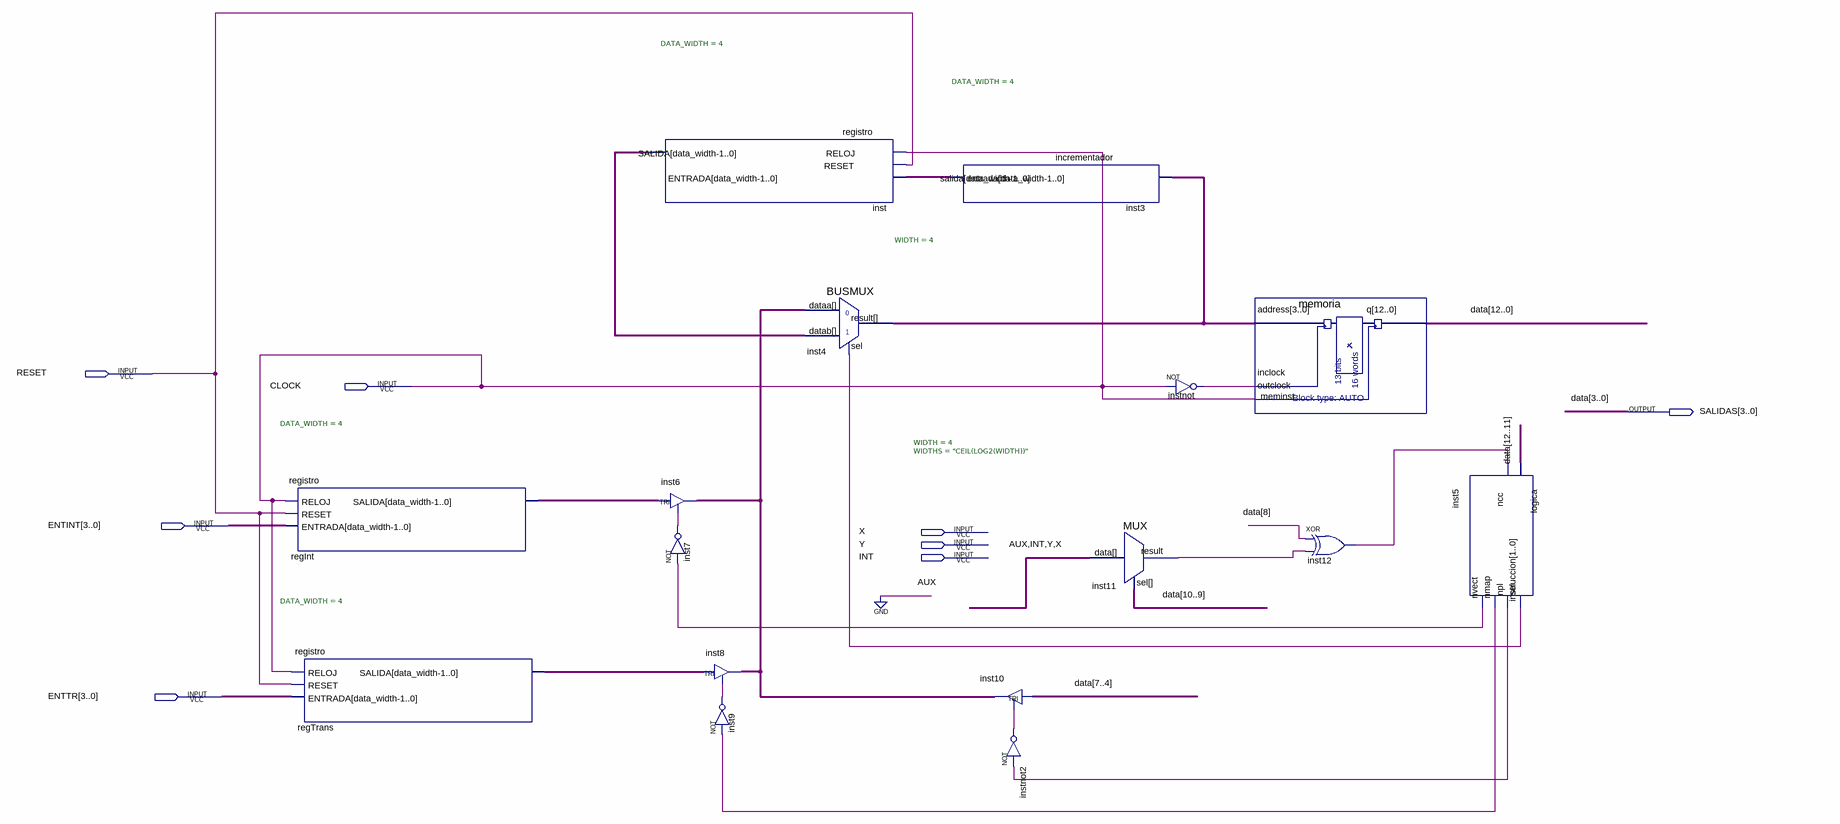
[diagram p0: schematic sheet]
// Quartus schematic secuenciador.bdf as structural Verilog: 16 symbols, 8 pins
module secuenciador (
  input  RESET,
  input  CLOCK,
  input  [3:0] ENTINT,
  input  X,
  input  Y,
  input  INT,
  input  [3:0] ENTTR,
  output [3:0] SALIDAS
);

  wire inst5_nmap, inst5_npl, inst5_nvect, inst5_sel, inst7_out, inst9_out, inst11_result, inst12_out,
       instnot2_out, instnot_out;
  wire [3:0] inst3_salida, inst4_result, inst6_out, inst_salida, regInt_salida, regTrans_salida;
  wire [12:4] data;

  registro #(.DATA_WIDTH(4)) regInt (.RELOJ(CLOCK), .RESET(RESET), .ENTRADA(ENTINT), .SALIDA(regInt_salida));
  registro #(.DATA_WIDTH(4)) regTrans (.RELOJ(CLOCK), .RESET(RESET), .ENTRADA(ENTTR), .SALIDA(regTrans_salida));
  registro #(.DATA_WIDTH(4)) inst (.RELOJ(CLOCK), .RESET(RESET), .ENTRADA(inst3_salida), .SALIDA(inst_salida));
  TRI inst6[3:0] (.IN(regInt_salida), .OE(inst7_out), .OUT(inst6_out));
  not inst7 (inst7_out, inst5_nvect);
  TRI inst8[3:0] (.IN(regTrans_salida), .OE(inst9_out), .OUT(inst6_out));
  not inst9 (inst9_out, inst5_nmap);
  BUSMUX #(.WIDTH(4)) inst4 (.datab(inst_salida), .sel(inst5_sel), .dataa(inst6_out), .result(inst4_result));
  incrementador #(.DATA_WIDTH(4)) inst3 (.entrada(inst4_result), .salida(inst3_salida));
  TRI inst10[3:0] (.IN(data[7:4]), .OE(instnot2_out), .OUT(inst6_out));
  not instnot2 (instnot2_out, inst5_npl);
  MUX #(.WIDTH(4), .WIDTHS("CEIL(LOG2(WIDTH))")) inst11 (
    .data({1'b0, INT, Y, X}), .sel(data[10:9]), .result(inst11_result));
  not instnot (instnot_out, CLOCK);
  memoria meminst (.address(inst4_result), .inclock(instnot_out), .outclock(CLOCK), .q({data, SALIDAS}));
  xor inst12 (inst12_out, data[8], inst11_result);
  logica inst5 (
    .instruccion(data[12:11]), .ncc(inst12_out), .sel(inst5_sel), .npl(inst5_npl), .nmap(inst5_nmap),
    .nvect(inst5_nvect));

  // Other names for the same wires on the sheet: data[3:0] = SALIDAS
endmodule
